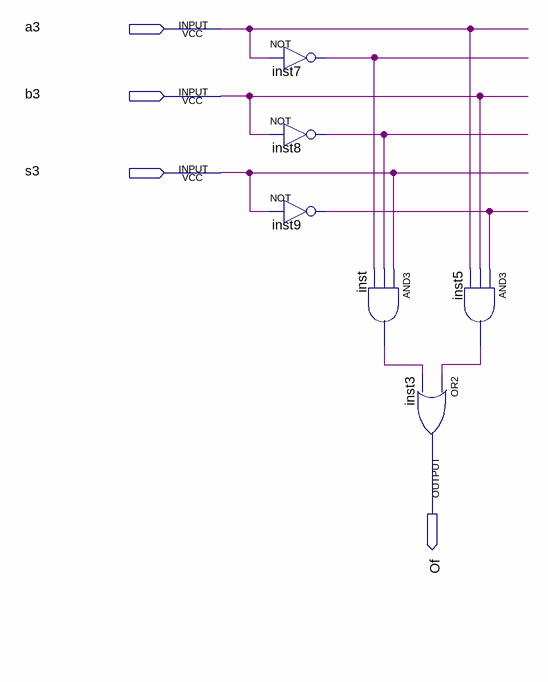
[diagram p0: schematic sheet]
// Quartus schematic overflow.bdf as structural Verilog: 6 symbols, 4 pins
module overflow (
  input  a3,
  input  b3,
  input  s3,
  output Of
);

  wire inst5_out, inst7_out, inst8_out, inst9_out, inst_out;

  not inst7 (inst7_out, a3);
  not inst8 (inst8_out, b3);
  not inst9 (inst9_out, s3);
  and inst (inst_out, s3, inst8_out, inst7_out);
  or inst3 (Of, inst5_out, inst_out);
  and inst5 (inst5_out, inst9_out, b3, a3);
endmodule
